# Altium schematic sheet PDC_Gain_Driver.SchDoc
size A
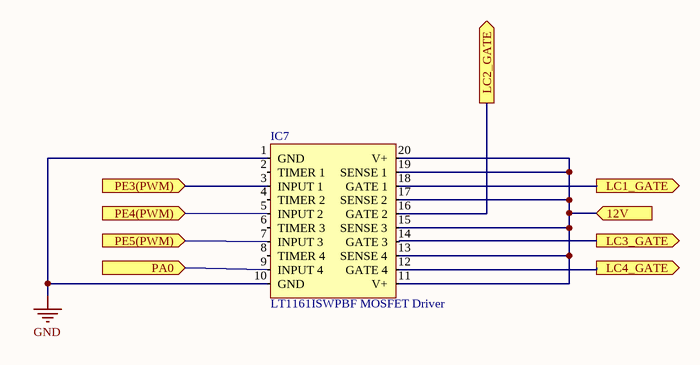
[diagram p0: PDC_Gain_Driver.SchDoc]

## Parts
IC7  LT1161ISWPBF MOSFET Driver  [SO-20]

## Ports
12V (in), LC1_GATE (out), LC2_GATE (out), LC3_GATE (out), LC4_GATE (out), PA0 (in), PE3(PWM) (in), PE4(PWM) (in), PE5(PWM) (in)

## Nets
GND: IC7.1(GND) IC7.10(GND)
12V: IC7.11(V+) IC7.13(SENSE_4) IC7.15(SENSE_3) IC7.17(SENSE_2) IC7.19(SENSE_1) IC7.20(V+) ; port 12V
LC1_GATE: IC7.18(GATE_1) ; port LC1_GATE
LC2_GATE: IC7.16(GATE_2) ; port LC2_GATE
LC3_GATE: IC7.14(GATE_3) ; port LC3_GATE
LC4_GATE: IC7.12(GATE_4) ; port LC4_GATE
PA0: IC7.9(INPUT_4) ; port PA0
PE3(PWM): IC7.3(INPUT_1) ; port PE3(PWM)
PE4(PWM): IC7.5(INPUT_2) ; port PE4(PWM)
PE5(PWM): IC7.7(INPUT_3) ; port PE5(PWM)

Not connected (* = marked no-connect by the designer): IC7 2(TIMER_1) 4(TIMER_2) 6(TIMER_3) 8(TIMER_4)

## Library data of the parts
IC7 = 16: Manufacturer_id: 1; idIC_Misc: 16; Created_By: Eunice Bernardo; Drawer_id: 1; Name: LT1161ISWPBF MOSFET Driver; Created_Date: 10/27/2018